# Altium schematic sheet [03] - FPGA - POWER.SchDoc
size A2; SheetNumber: 3; SheetTotal: 4
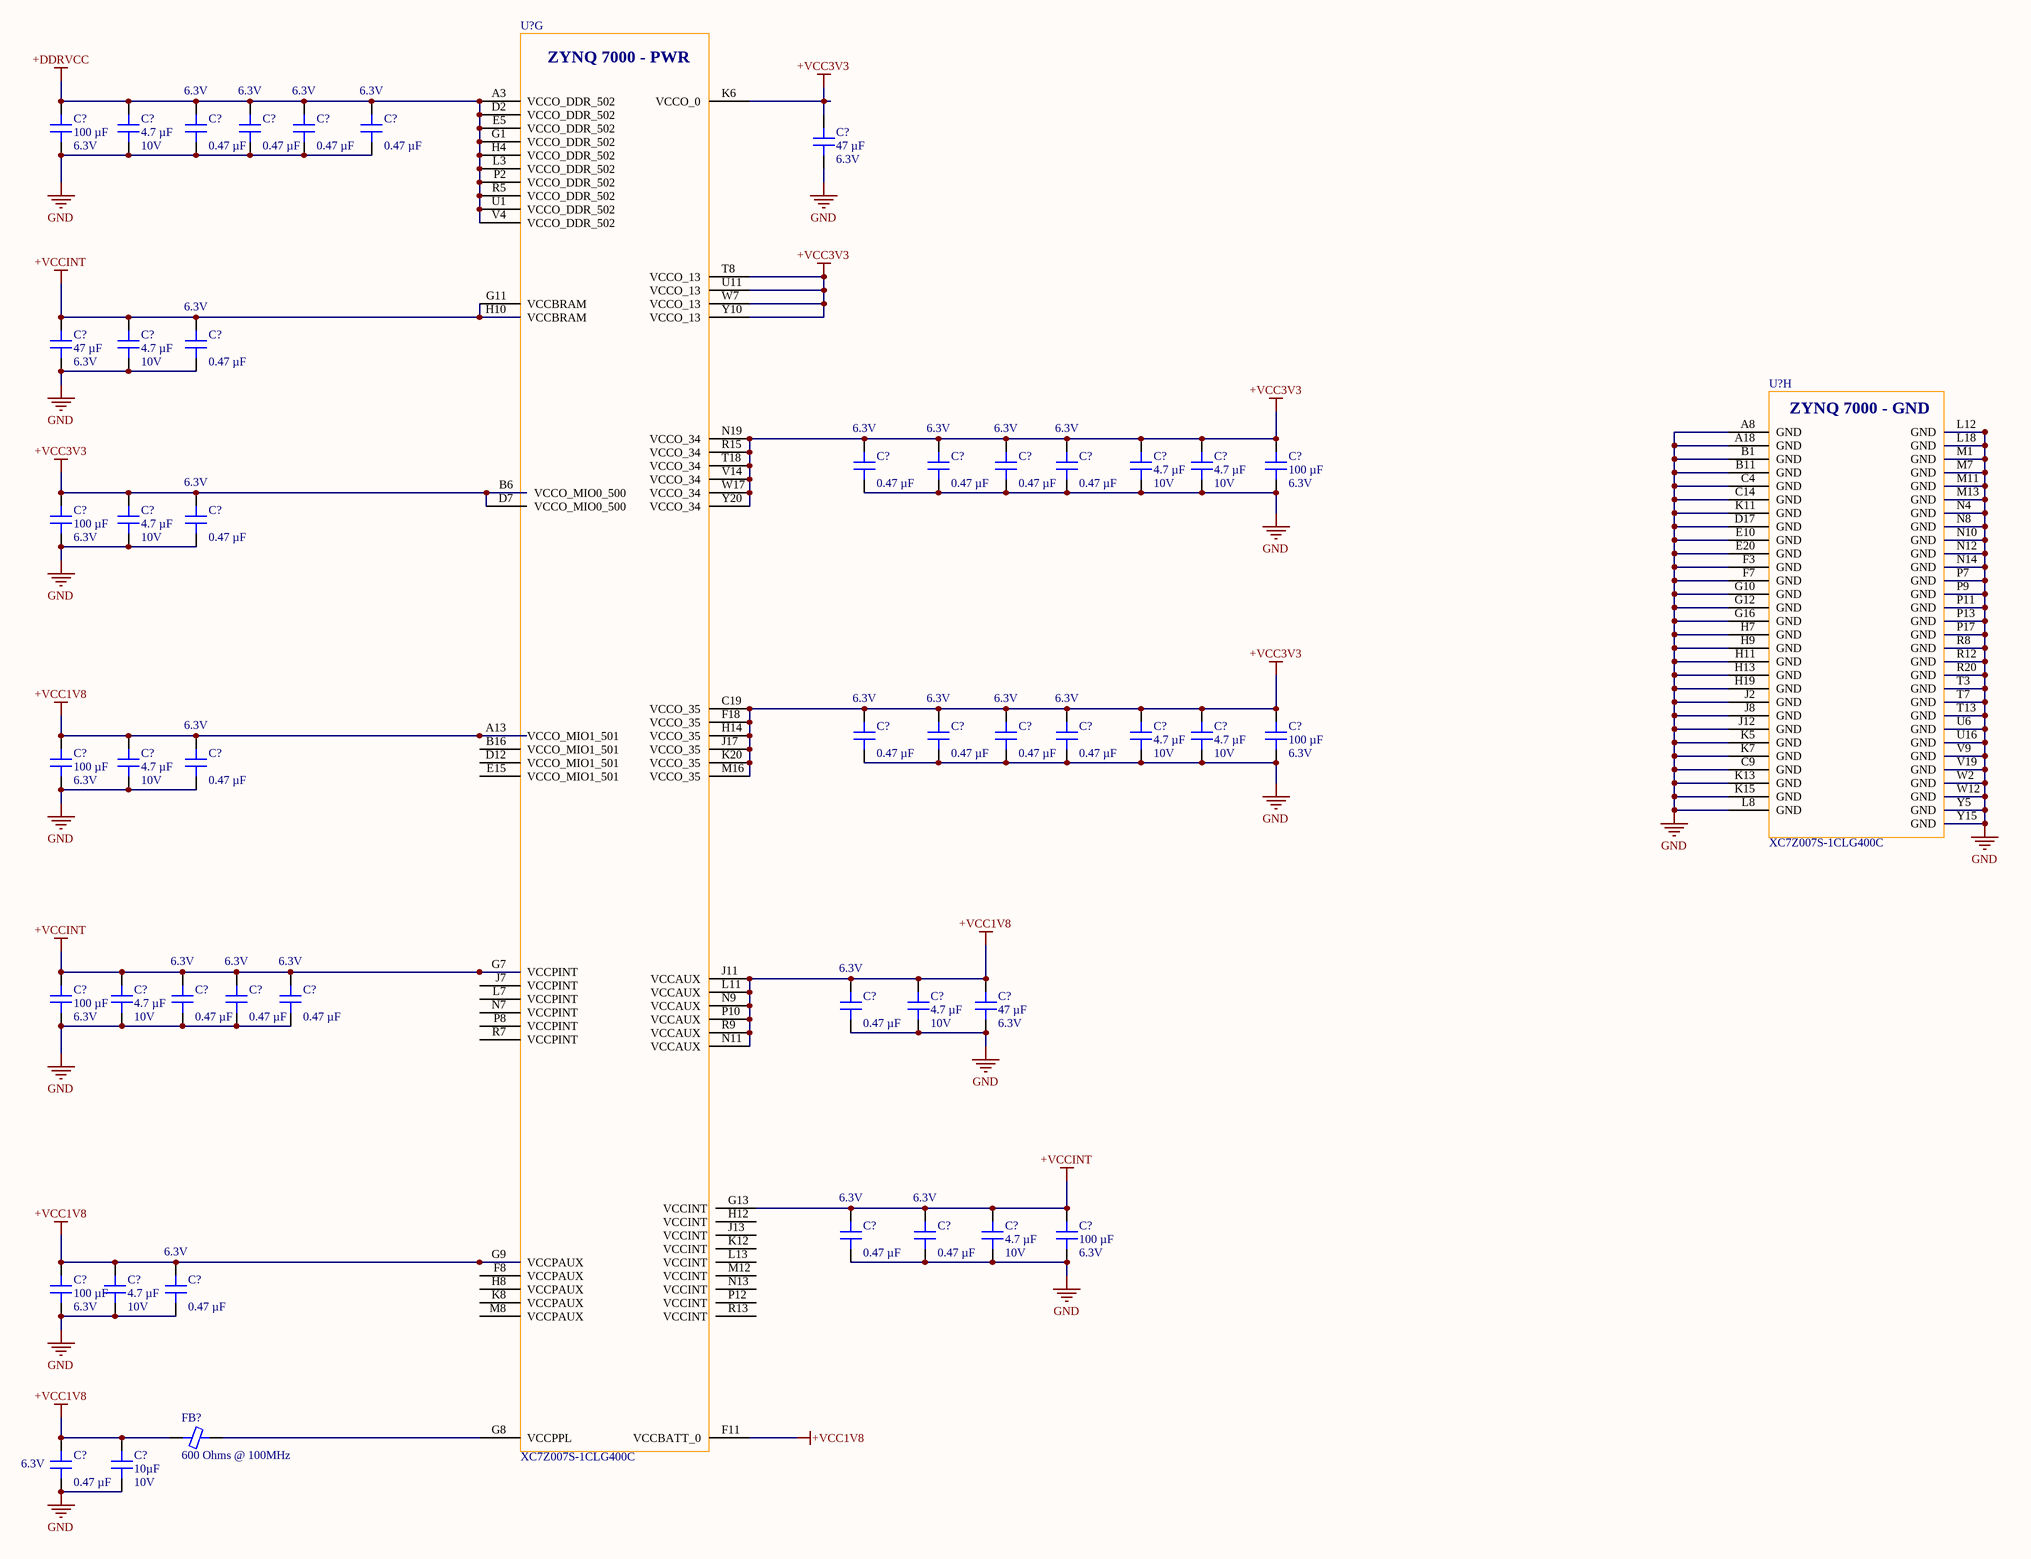
[diagram p0: [03] - FPGA - POWER.SchDoc]

## Parts
(Parts that share a designator on the sheet are numbered #1, #2 ... from top to bottom, then left to right.)
C?#1  Voltage - Rated: 6.3V  [CAP 1210_3225 - 1MM]  (hidden comment: 100 µF)
C?#2  Voltage - Rated: 10V  [CAP 0402_1005]  (hidden comment: 4.7 µF)
C?#3  Voltage - Rated: 6.3V  [CAP 0201_0603]  (hidden comment: 0.47 µF)
C?#4  Voltage - Rated: 6.3V  [CAP 0201_0603]  (hidden comment: 0.47 µF)
C?#5  Voltage - Rated: 6.3V  [CAP 0201_0603]  (hidden comment: 0.47 µF)
C?#6  Voltage - Rated: 6.3V  [CAP 0201_0603]  (hidden comment: 0.47 µF)
C?#7  Voltage - Rated: 6.3V  [CAP 0805_2012]  (hidden comment: 47 µF)
C?#8  Voltage - Rated: 6.3V  [CAP 0805_2012]  (hidden comment: 47 µF)
C?#9  Voltage - Rated: 10V  [CAP 0402_1005]  (hidden comment: 4.7 µF)
C?#10  Voltage - Rated: 6.3V  [CAP 0201_0603]  (hidden comment: 0.47 µF)
C?#11  Voltage - Rated: 6.3V  [CAP 0201_0603]  (hidden comment: 0.47 µF)
C?#12  Voltage - Rated: 6.3V  [CAP 0201_0603]  (hidden comment: 0.47 µF)
C?#13  Voltage - Rated: 6.3V  [CAP 0201_0603]  (hidden comment: 0.47 µF)
C?#14  Voltage - Rated: 6.3V  [CAP 0201_0603]  (hidden comment: 0.47 µF)
C?#15  Voltage - Rated: 10V  [CAP 0402_1005]  (hidden comment: 4.7 µF)
C?#16  Voltage - Rated: 10V  [CAP 0402_1005]  (hidden comment: 4.7 µF)
C?#17  Voltage - Rated: 6.3V  [CAP 1210_3225 - 1MM]  (hidden comment: 100 µF)
C?#18  Voltage - Rated: 6.3V  [CAP 1210_3225 - 1MM]  (hidden comment: 100 µF)
C?#19  Voltage - Rated: 10V  [CAP 0402_1005]  (hidden comment: 4.7 µF)
C?#20  Voltage - Rated: 6.3V  [CAP 0201_0603]  (hidden comment: 0.47 µF)
C?#21  Voltage - Rated: 6.3V  [CAP 0201_0603]  (hidden comment: 0.47 µF)
C?#22  Voltage - Rated: 6.3V  [CAP 0201_0603]  (hidden comment: 0.47 µF)
C?#23  Voltage - Rated: 6.3V  [CAP 0201_0603]  (hidden comment: 0.47 µF)
C?#24  Voltage - Rated: 6.3V  [CAP 0201_0603]  (hidden comment: 0.47 µF)
C?#25  Voltage - Rated: 10V  [CAP 0402_1005]  (hidden comment: 4.7 µF)
C?#26  Voltage - Rated: 10V  [CAP 0402_1005]  (hidden comment: 4.7 µF)
C?#27  Voltage - Rated: 6.3V  [CAP 1210_3225 - 1MM]  (hidden comment: 100 µF)
C?#28  Voltage - Rated: 6.3V  [CAP 1210_3225 - 1MM]  (hidden comment: 100 µF)
C?#29  Voltage - Rated: 10V  [CAP 0402_1005]  (hidden comment: 4.7 µF)
C?#30  Voltage - Rated: 6.3V  [CAP 0201_0603]  (hidden comment: 0.47 µF)
C?#31  Voltage - Rated: 6.3V  [CAP 1210_3225 - 1MM]  (hidden comment: 100 µF)
C?#32  Voltage - Rated: 10V  [CAP 0402_1005]  (hidden comment: 4.7 µF)
C?#33  Voltage - Rated: 6.3V  [CAP 0201_0603]  (hidden comment: 0.47 µF)
C?#34  Voltage - Rated: 6.3V  [CAP 0201_0603]  (hidden comment: 0.47 µF)
C?#35  Voltage - Rated: 6.3V  [CAP 0201_0603]  (hidden comment: 0.47 µF)
C?#36  Voltage - Rated: 6.3V  [CAP 0201_0603]  (hidden comment: 0.47 µF)
C?#37  Voltage - Rated: 10V  [CAP 0402_1005]  (hidden comment: 4.7 µF)
C?#38  Voltage - Rated: 6.3V  [CAP 0805_2012]  (hidden comment: 47 µF)
C?#39  Voltage - Rated: 6.3V  [CAP 0201_0603]  (hidden comment: 0.47 µF)
C?#40  Voltage - Rated: 6.3V  [CAP 0201_0603]  (hidden comment: 0.47 µF)
C?#41  Voltage - Rated: 10V  [CAP 0402_1005]  (hidden comment: 4.7 µF)
C?#42  Voltage - Rated: 6.3V  [CAP 1210_3225 - 1MM]  (hidden comment: 100 µF)
C?#43  Voltage - Rated: 6.3V  [CAP 1210_3225 - 1MM]  (hidden comment: 100 µF)
C?#44  Voltage - Rated: 10V  [CAP 0402_1005]  (hidden comment: 4.7 µF)
C?#45  Voltage - Rated: 6.3V  [CAP 0201_0603]  (hidden comment: 0.47 µF)
C?#46  Voltage - Rated: 6.3V  [CAP 0201_0603]  (hidden comment: 0.47 µF)
C?#47  Voltage - Rated: 10V  [CAP 0603_1608]  (hidden comment: 10µF)
FB?  600 Ohms @ 100MHz  [FER 0603_1608]
U?#1  XC7Z007S-1CLG400C  [CLG400_XIL]  (part G of 8)
U?#2  XC7Z007S-1CLG400C  [CLG400_XIL]  (part H of 8)

## Nets
+DDRVCC: C?#1.2 C?#2.2 C?#3.2 C?#4.2 C?#5.2 C?#6.2 U?#1.A3(VCCO_DDR_502) U?#1.D2(VCCO_DDR_502) U?#1.E5(VCCO_DDR_502) U?#1.G1(VCCO_DDR_502) U?#1.H4(VCCO_DDR_502) U?#1.L3(VCCO_DDR_502) U?#1.P2(VCCO_DDR_502) U?#1.R5(VCCO_DDR_502) U?#1.U1(VCCO_DDR_502) U?#1.V4(VCCO_DDR_502)
+VCC1V8: C?#28.2 C?#29.2 C?#30.2 C?#36.2 C?#37.2 C?#38.2 C?#43.2 C?#44.2 C?#45.2 C?#46.2 C?#47.2 FB?.1 U?#1.A13(VCCO_MIO1_501) U?#1.F11(VCCBATT_0) U?#1.G9(VCCPAUX) U?#1.J11(VCCAUX) U?#1.L11(VCCAUX) U?#1.N9(VCCAUX) U?#1.N11(VCCAUX) U?#1.P10(VCCAUX) U?#1.R9(VCCAUX)
+VCC3V3: C?#7.2 C?#11.2 C?#12.2 C?#13.2 C?#14.2 C?#15.2 C?#16.2 C?#17.2 C?#18.2 C?#19.2 C?#20.2 C?#21.2 C?#22.2 C?#23.2 C?#24.2 C?#25.2 C?#26.2 C?#27.2 U?#1.B6(VCCO_MIO0_500) U?#1.C19(VCCO_35) U?#1.D7(VCCO_MIO0_500) U?#1.F18(VCCO_35) U?#1.H14(VCCO_35) U?#1.J17(VCCO_35) U?#1.K6(VCCO_0) U?#1.K20(VCCO_35) U?#1.M16(VCCO_35) U?#1.N19(VCCO_34) U?#1.R15(VCCO_34) U?#1.T8(VCCO_13) U?#1.T18(VCCO_34) U?#1.U11(VCCO_13) U?#1.V14(VCCO_34) U?#1.W7(VCCO_13) U?#1.W17(VCCO_34) U?#1.Y10(VCCO_13) U?#1.Y20(VCCO_34)
+VCCINT: C?#8.2 C?#9.2 C?#10.2 C?#31.2 C?#32.2 C?#33.2 C?#34.2 C?#35.2 C?#39.2 C?#40.2 C?#41.2 C?#42.2 U?#1.G7(VCCPINT) U?#1.G11(VCCBRAM) U?#1.G13(VCCINT) U?#1.H10(VCCBRAM)
GND: C?#1.1 C?#2.1 C?#3.1 C?#4.1 C?#5.1 C?#6.1 C?#7.1 C?#8.1 C?#9.1 C?#10.1 C?#11.1 C?#12.1 C?#13.1 C?#14.1 C?#15.1 C?#16.1 C?#17.1 C?#18.1 C?#19.1 C?#20.1 C?#21.1 C?#22.1 C?#23.1 C?#24.1 C?#25.1 C?#26.1 C?#27.1 C?#28.1 C?#29.1 C?#30.1 C?#31.1 C?#32.1 C?#33.1 C?#34.1 C?#35.1 C?#36.1 C?#37.1 C?#38.1 C?#39.1 C?#40.1 C?#41.1 C?#42.1 C?#43.1 C?#44.1 C?#45.1 C?#46.1 C?#47.1 U?#2.A8(GND) U?#2.A18(GND) U?#2.B1(GND) U?#2.B11(GND) U?#2.C4(GND) U?#2.C9(GND) U?#2.C14(GND) U?#2.D17(GND) U?#2.E10(GND) U?#2.E20(GND) U?#2.F3(GND) U?#2.F7(GND) U?#2.G10(GND) U?#2.G12(GND) U?#2.G16(GND) U?#2.H7(GND) U?#2.H9(GND) U?#2.H11(GND) U?#2.H13(GND) U?#2.H19(GND) U?#2.J2(GND) U?#2.J8(GND) U?#2.J12(GND) U?#2.K5(GND) U?#2.K7(GND) U?#2.K11(GND) U?#2.K13(GND) U?#2.K15(GND) U?#2.L8(GND) U?#2.L12(GND) U?#2.L18(GND) U?#2.M1(GND) U?#2.M7(GND) U?#2.M11(GND) U?#2.M13(GND) U?#2.N4(GND) U?#2.N8(GND) U?#2.N10(GND) U?#2.N12(GND) U?#2.N14(GND) U?#2.P7(GND) U?#2.P9(GND) U?#2.P11(GND) U?#2.P13(GND) U?#2.P17(GND) U?#2.R8(GND) U?#2.R12(GND) U?#2.R20(GND) U?#2.T3(GND) U?#2.T7(GND) U?#2.T13(GND) U?#2.U6(GND) U?#2.U16(GND) U?#2.V9(GND) U?#2.V19(GND) U?#2.W2(GND) U?#2.W12(GND) U?#2.Y5(GND) U?#2.Y15(GND)
NetFB?_2: FB?.2 U?#1.G8(VCCPPL)

Not connected (* = marked no-connect by the designer): U?#1 B16(VCCO_MIO1_501) D12(VCCO_MIO1_501) E15(VCCO_MIO1_501) F8(VCCPAUX) H8(VCCPAUX) H12(VCCINT) J7(VCCPINT) J13(VCCINT) K8(VCCPAUX) K12(VCCINT) L7(VCCPINT) L13(VCCINT) M8(VCCPAUX) M12(VCCINT) N7(VCCPINT) N13(VCCINT) P8(VCCPINT) P12(VCCINT) R7(VCCPINT) R13(VCCINT)

## Notes on the sheet
- (in symbol XC7Z007S-1CLG400C, part G) ZYNQ 7000 - PWR
- (in symbol XC7Z007S-1CLG400C, part H) ZYNQ 7000 - GND

## Library data of the parts
C?#1 C?#17 C?#18 C?#27 C?#28 C?#31 C?#42 C?#43 = GRM32EC70J107ME15L: CAP CER 100UF 6.3V X7S 1210; manufacturer: Murata Electronics; Tolerance: ±20%; Part Number: GRM32EC70J107ME15L; Value: 100 µF; Applications: General Purpose; Capacitance: 100 µF; componentlink1description: Datasheet; componentlink1url: https://search.murata.co.jp/Ceramy/image/img/A01X/G101/ENG/GRM32EC70J107ME15-01.pdf; componentlink2description: DigiKey Link; componentlink2url: https://www.digikey.com/en/products/detail/murata-electronics/GRM32EC70J107ME15L/5027614; Device Package: 1210 (3225 Metric); lastupdated: 26.04.2023 19:29:36; Lifecycle Status: Active; Minimum Order: 1; Mounting Type: Surface Mount, MLCC; Operating Temperature: -55°C ~ 125°C; Package / Case: 1210 (3225 Metric); packaging: TapeAndReel; partid: 23659; Part Status: Active; price: 0.16; series: GRM; Size / Dimension: 0.126" L x 0.098" W (3.20mm x 2.50mm); Supplier 1: DigiKey; Supplier Part Number 1: 490-10530-1-ND; Temperature Coefficient: X7S; Thickness (Max): 0.106" (2.70mm)
C?#2 C?#9 C?#15 C?#16 C?#19 C?#25 C?#26 C?#29 C?#32 C?#37 C?#41 C?#44 = GMC04X5R475K10NT: CAP0402 X5R 4.7UF 10% 10V; manufacturer: Cal-Chip Electronics, Inc.; Part Number: GMC04X5R475K10NT; Value: 4.7 µF; Applications: General Purpose; Capacitance: 4.7 µF; componentlink1description: Datasheet; componentlink1url: https://88ce57.p3cdn1.secureserver.net/wp-content/uploads/2023/01/gmc_series-2.pdf; componentlink2description: DigiKey Link; componentlink2url: https://www.digikey.com/en/products/detail/cal-chip-electronics-inc/GMC04X5R475K10NT/18151135; Device Package: 0402 (1005 Metric); lastupdated: 26.04.2023 19:01:59; Lifecycle Status: Active; Minimum Order: 1; Mounting Type: Surface Mount, MLCC; Operating Temperature: -55°C ~ 85°C; Package / Case: 0402 (1005 Metric); packaging: TapeAndReel; partid: 49814; Part Status: Active; price: 0.01; series: GMC; Size / Dimension: 0.039" L x 0.020" W (1.00mm x 0.50mm); Supplier 1: DigiKey; Supplier Part Number 1: 4713-GMC04X5R475K10NTCT-ND; Temperature Coefficient: X5R; Thickness (Max): 0.028" (0.70mm); Tolerance: ±10%
C?#3-C?#6 C?#10-C?#14 C?#20-C?#24 C?#30 C?#33-C?#36 C?#39 C?#40 C?#45 C?#46 = JMK063BC6474KP-F: CAP CER 0.47UF 6.3V X6S 0201; manufacturer: Taiyo Yuden; Tolerance: ±10%; Part Number: JMK063BC6474KP-F; Value: 0.47 µF; Applications: SMPS Filtering; Capacitance: 0.47 µF; componentlink1description: Datasheet; componentlink1url: https://ds.yuden.co.jp/TYCOMPAS/ut/detail?pn=JMK063BC6474KP-F&u=M; componentlink2description: DigiKey Link; componentlink2url: https://www.digikey.com/en/products/detail/taiyo-yuden/JMK063BC6474KP-F/9947925; Device Package: 0201 (0603 Metric); lastupdated: 26.04.2023 19:00:46; Lifecycle Status: Active; Minimum Order: 1; Mounting Type: Surface Mount, MLCC; Operating Temperature: -55°C ~ 105°C; Package / Case: 0201 (0603 Metric); packaging: TapeAndReel; partid: 108; Part Status: Active; price: 0.01; series: M; Size / Dimension: 0.024" L x 0.012" W (0.60mm x 0.30mm); Supplier 1: DigiKey; Supplier Part Number 1: 587-6386-1-ND; Temperature Coefficient: X6S; Thickness (Max): 0.015" (0.39mm)
C?#7 C?#8 C?#38 = CL21A476MQYNNNE: CAP CER 47UF 6.3V X5R 0805; manufacturer: Samsung Electro-Mechanics; Tolerance: ±20%; Part Number: CL21A476MQYNNNE; Value: 47 µF; Applications: General Purpose; Capacitance: 47 µF; componentlink1description: Datasheet; componentlink1url: http://www.samsungsem.com/kr/support/product-search/mlcc/CL21A476MQYNNNE.jsp; componentlink2description: DigiKey Link; componentlink2url: https://www.digikey.com/en/products/detail/samsung-electro-mechanics/CL21A476MQYNNNE/3887510; Device Package: 0805 (2012 Metric); lastupdated: 26.04.2023 19:09:50; Lifecycle Status: Active; Minimum Order: 1; Mounting Type: Surface Mount, MLCC; Operating Temperature: -55°C ~ 85°C; Package / Case: 0805 (2012 Metric); packaging: TapeAndReel; partid: 3143; Part Status: Active; price: 0.04; series: CL; Size / Dimension: 0.079" L x 0.049" W (2.00mm x 1.25mm); Supplier 1: DigiKey; Supplier Part Number 1: 1276-1852-1-ND; Temperature Coefficient: X5R; Thickness (Max): 0.057" (1.45mm)
C?#47 = 0603ZD106KAT2A: CAP CER 10UF 10V X5R 0603; manufacturer: AVX Corporation; Tolerance: ±10%; Part Number: 0603ZD106KAT2A; Value: 10µF; Applications: General Purpose; Capacitance: 10µF; componentlink1description: Datasheet; componentlink1url: http://datasheets.avx.com/cx5r.pdf; componentlink2description: DigiKey Link; componentlink2url: http://digikey.com/product-detail/en/avx-corporation/0603ZD106KAT2A/478-10766-1-ND/7536554; Device Package: 0603 (1608 Metric); lastupdated: 2.09.2020 01:03:35; Lifecycle Status: Active; Minimum Order: 1; Mounting Type: Surface Mount, MLCC; Operating Temperature: -55°C ~ 85°C; Package / Case: 0603 (1608 Metric); packaging: TapeAndReel; partid: 2590; Part Status: Active; price: 0.08; series: -; Size / Dimension: 0.063" L x 0.032" W (1.60mm x 0.81mm); Supplier 1: DigiKey; Supplier Part Number 1: 478-10766-1-ND; Temperature Coefficient: X5R; Thickness (Max): 0.037" (0.94mm)
FB? = BLM18DN601SZ1D: FERRITEBEAD SMD Z100MHZ=600OHM 7; Manufacturer: Murata Electronics; Current Rating (Max): 700mA; Number of Lines: 1; Part Number: BLM18DN601SZ1D; ComponentLink1Description: Datasheet; ComponentLink1URL: https://www.murata.com/en-us/api/pdfdownloadapi?cate=luNoiseSupprFilteChipFerriBead&partno=BLM18DN601SZ1%23; ComponentLink2Description: DigiKey Link; ComponentLink2URL: http://digikey.com/product-detail/en/murata-electronics/BLM18DN601SZ1D/490-18575-1-ND/10135586; Device Package: 0603 (1608 Metric); Height (Max): 0.037" (0.95mm); Impedance @ Frequency: 600 Ohms @ 100MHz; LastUpdated: 2.09.2020 01:18:18; Lifecycle Status: Active; Minimum Order: 1; Mounting Type: Surface Mount; Operating Temperature: -55°C ~ 125°C; Package / Case: 0603 (1608 Metric); Packaging: TapeAndReel; PartId: 783; Part Status: Active; Price: 0.05; Ratings: AEC-Q200; Series: EMIFIL®, BLM18; Size / Dimension: 0.063" L x 0.031" W (1.60mm x 0.80mm); Supplier 1: DigiKey; Supplier Part Number 1: 490-18575-1-ND; Value: 600 Ohms @ 100MHz
U?#1 U?#2 = XC7Z007S-1CLG400C: No Description Available; Mfr_Name: Xilinx Inc; RefDes: RefDes; Type: Type